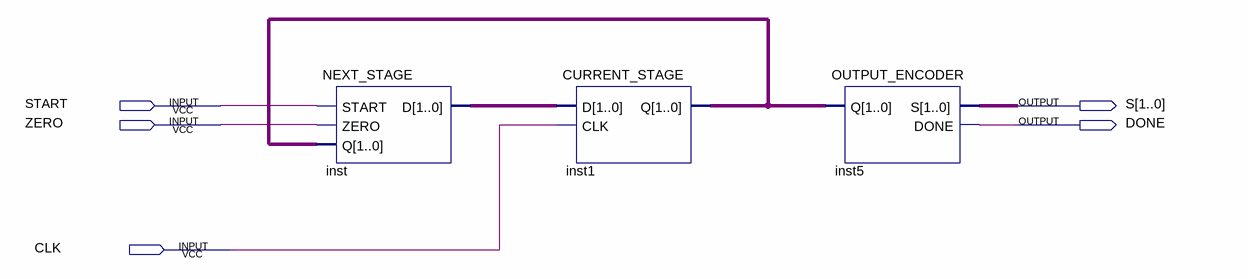
[diagram p0: schematic sheet]
// Quartus schematic CONTROLER.bdf as structural Verilog: 3 symbols, 5 pins
module CONTROLER (
  input  START,
  input  ZERO,
  input  CLK,
  output [1:0] S,
  output DONE
);

  wire [1:0] inst1_q, inst_d;

  NEXT_STAGE inst (.START(START), .ZERO(ZERO), .Q(inst1_q), .D(inst_d));
  CURRENT_STAGE inst1 (.D(inst_d), .CLK(CLK), .Q(inst1_q));
  OUTPUT_ENCODER inst5 (.Q(inst1_q), .S(S), .DONE(DONE));
endmodule
